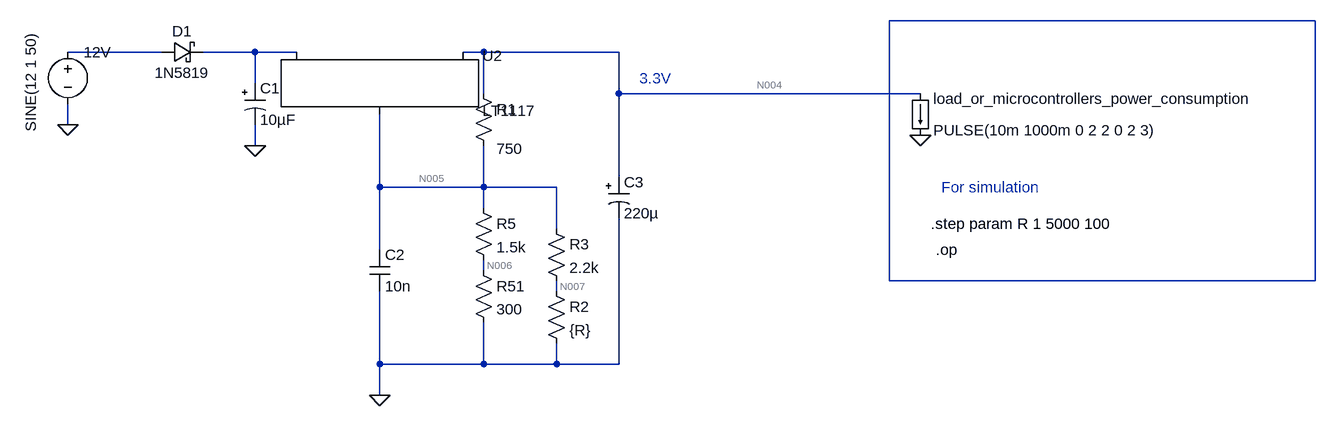
[diagram p0: schematic Variable-3V3 source for Offset_5k.asc]
Variable-3V3 source for Offset_5k.asc, the LTspice schematic file:
Version 4
SHEET 1 956 740
WIRE 64 16 -592 16
WIRE -1712 64 -1856 64
WIRE -1568 64 -1648 64
WIRE -1504 64 -1568 64
WIRE -1216 64 -1248 64
WIRE -1008 64 -1216 64
WIRE -1568 112 -1568 64
WIRE -1216 128 -1216 64
WIRE -1008 128 -1008 64
WIRE -544 128 -1008 128
WIRE -1856 176 -1856 144
WIRE -1568 208 -1568 176
WIRE -1008 256 -1008 128
WIRE -1376 272 -1376 160
WIRE -1216 272 -1216 208
WIRE -1216 272 -1376 272
WIRE -1104 272 -1216 272
WIRE -1216 304 -1216 272
WIRE -1104 336 -1104 272
WIRE -1376 368 -1376 272
WIRE -1216 400 -1216 384
WIRE -592 416 -592 16
WIRE 64 416 64 16
WIRE 64 416 -592 416
WIRE -1104 432 -1104 416
WIRE -1376 544 -1376 432
WIRE -1216 544 -1216 480
WIRE -1216 544 -1376 544
WIRE -1104 544 -1104 512
WIRE -1104 544 -1216 544
WIRE -1008 544 -1008 320
WIRE -1008 544 -1104 544
WIRE -1376 592 -1376 544
FLAG -1376 592 0
FLAG -1856 176 0
FLAG -544 192 0
FLAG -1568 208 0
SYMBOL PowerProducts\\LT1117 -1376 64 R0
SYMATTR InstName U2
SYMBOL voltage -1856 48 R0
WINDOW 123 0 0 Left 0
WINDOW 39 0 0 Left 0
WINDOW 3 -57 -14 VRight 2
SYMATTR Value SINE(12 1 50)
SYMATTR InstName 12V
SYMBOL res -1232 112 R0
WINDOW 3 36 101 Left 2
SYMATTR Value 750
SYMATTR InstName R1
SYMBOL cap -1392 368 R0
SYMATTR InstName C2
SYMATTR Value 10n
SYMBOL load -560 128 R0
WINDOW 123 0 0 Left 0
WINDOW 39 0 0 Left 0
SYMATTR InstName load_or_microcontrollers_power_consumption
SYMATTR Value PULSE(10m 1000m 0 2 2 0 2 3)
SYMBOL res -1232 288 R0
SYMATTR InstName R5
SYMATTR Value 1.5k
SYMBOL schottky -1712 80 R270
WINDOW 0 32 32 VTop 2
WINDOW 3 0 32 VBottom 2
SYMATTR InstName D1
SYMATTR Value 1N5819
SYMATTR Description Diode
SYMATTR Type diode
SYMBOL polcap -1584 112 R0
WINDOW 3 24 56 Left 2
SYMATTR Value 10µF
SYMATTR InstName C1
SYMATTR Description Capacitor
SYMATTR Type cap
SYMATTR SpiceLine V=16 Irms=540m Rser=0.24 Lser=4.5n
SYMBOL polcap -1024 256 R0
WINDOW 3 24 56 Left 2
SYMATTR Value 220µ
SYMATTR InstName C3
SYMATTR Description Capacitor
SYMATTR Type cap
SYMBOL res -1120 416 R0
SYMATTR InstName R2
SYMATTR Value {R}
SYMBOL res -1232 384 R0
SYMATTR InstName R51
SYMATTR Value 300
SYMBOL res -1120 320 R0
SYMATTR InstName R3
SYMATTR Value 2.2k
TEXT -512 272 Left 2 ;For simulation
TEXT -976 104 Left 2 ;3.3V
TEXT -528 328 Left 2 !.step param R 1 5000 100
TEXT -520 368 Left 2 !.op

The netlist it stands for:
* Variable-3V3 source for Offset_5k.asc
XU2 N005 N004 N003 LT1117
V§12V N002 0 SINE(12 1 50)
R1 N004 N005 750
C2 N005 0 10n
I§load_or_microcontrollers_power_consumption N004 0 PULSE(10m 1000m 0 2 2 0 2 3)
R5 N005 N006 1.5k
D1 N002 N003 1N5819
C1 N003 0 10µF V=16 Irms=540m Rser=0.24 Lser=4.5n
C3 N004 0 220µ
R2 N007 0 {R}
R51 N006 0 300
R3 N005 N007 2.2k
.model D D
.lib standard.dio
* For simulation
* 3.3V
.step param R 1 5000 100
.op
.lib LT1117.lib
.backanno
.end

* Results of the author's LTspice run, read from the files saved beside the schematic
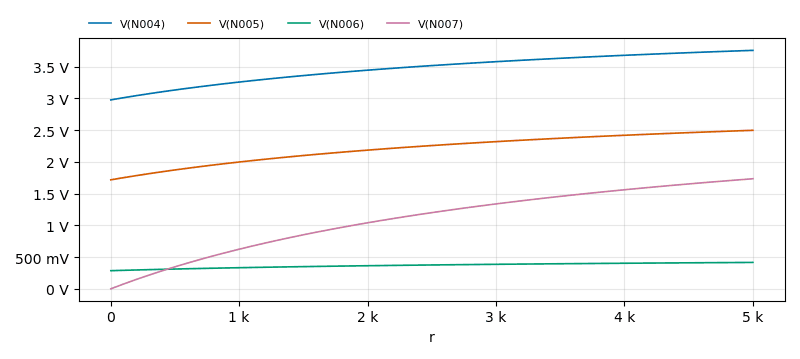
[diagram p1: Operating Point of Variable-3V3 source for Offset_5k.asc, plotted from the saved traces]
* Operating Point, 1 run:
*   V(N004): 2.978 V at r=1 , 3.758 V at r=5 k, min 2.978 V, max 3.758 V
*   V(N005): 1.718 V at r=1 , 2.498 V at r=5 k, min 1.718 V, max 2.498 V
*   V(N006): 286.3 mV at r=1 , 416.4 mV at r=5 k, min 286.3 mV, max 416.4 mV
*   V(N007): 780.5 µV at r=1 , 1.735 V at r=5 k, min 780.5 µV, max 1.735 V
* From the log:
*   Semiconductor Device Operating Points:
*                           --- Diodes ---
*   Name:    d:u2:1      d:u2:2      d:u2:3      d:u2:5        d1
*   Model:    u2:im       u2:do      u2:55ua     u2:10k      1n5819
*   Id:      1.70e-03    9.98e-03    5.50e-05   -9.88e-08    1.17e-02
*   Vd:      8.81e+00    9.63e-01    1.01e+01   -9.88e-04    2.11e-01
*   Req:     1.00e-02    1.00e+01    1.00e-04    1.00e-04    3.02e+00
*   CAP:     0.00e+00    0.00e+00    0.00e+00    0.00e+00    1.19e-10
*                           --- VDMOSFET Transistors ---
*   Name:        m:u2:1
*   Model:        u2:q
*   Id:          9.98e-03
*   Vgs:         1.58e-04
*   Vds:         7.85e+00
*   Vth:         0.00e+00
*   Gm:          1.26e+02
*   Gds:         0.00e+00
*   Cgs:         0.00e+00
*   Cgd:         0.00e+00
*   Cbody:       0.00e+00